# EAGLE design Adafruit T-Cobbler (EAGLE 6.2)
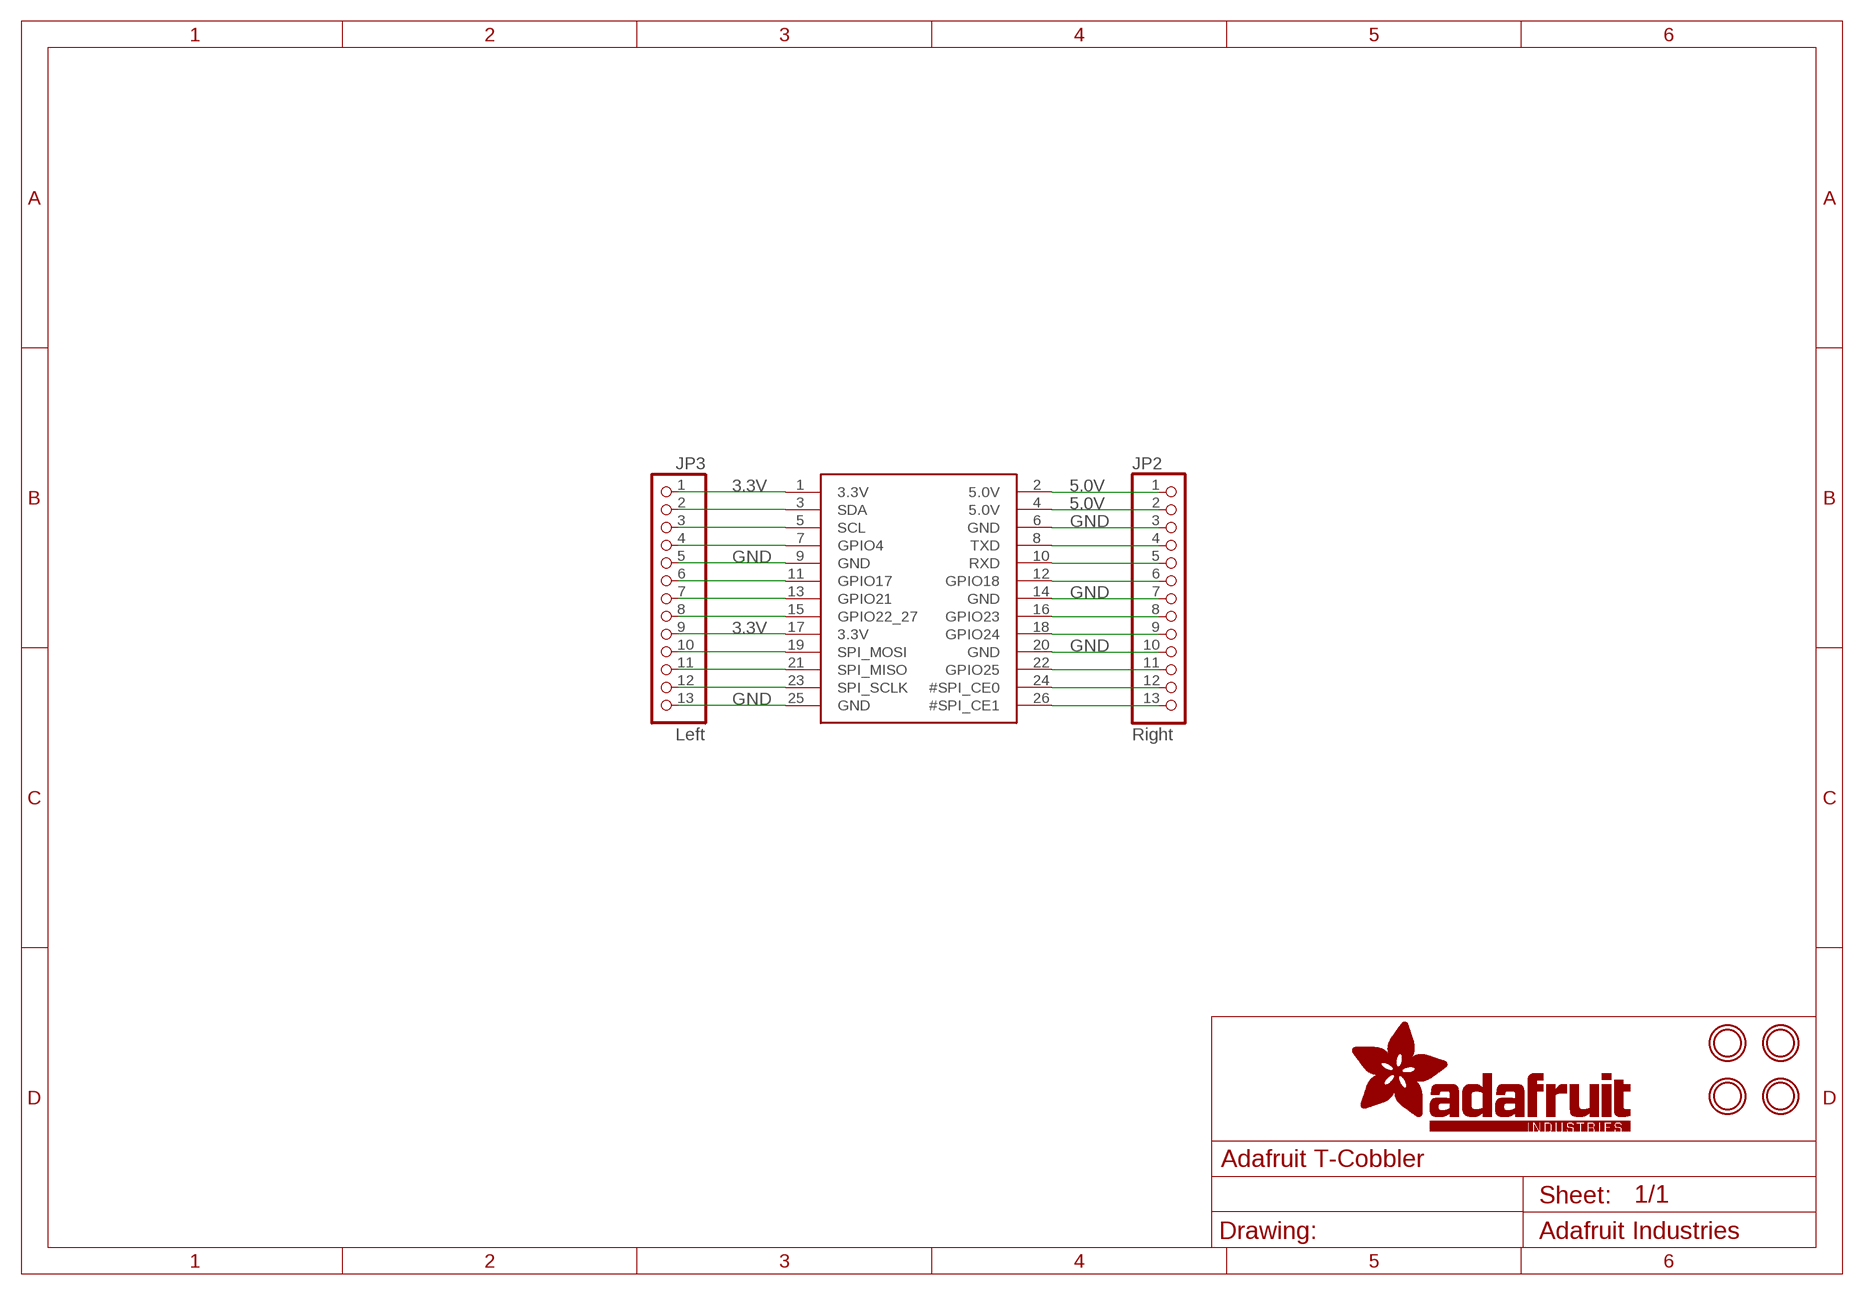
[diagram p0: schematic, sheet 1]

## Parts
JP1  PI  RASBERRYPI_IDC  [RASBERRYPI_IDC]
JP2  Right  HEADER-1X13  [1X13_ROUND_70]
JP3  Left  HEADER-1X13  [1X13_ROUND_70]
U$2  MOUNTINGHOLE2.5  [MOUNTINGHOLE_2.5_PLATED]
U$3  MOUNTINGHOLE2.5  [MOUNTINGHOLE_2.5_PLATED]
U$4  MOUNTINGHOLE2.5  [MOUNTINGHOLE_2.5_PLATED]
U$5  MOUNTINGHOLE2.5  [MOUNTINGHOLE_2.5_PLATED]

## Nets
3.3V: JP1.1(3.3V) JP1.17(3.3V) JP3.1 JP3.9
5.0V: JP1.2(5.0V) JP1.4(5.0V) JP2.1 JP2.2
GND: JP1.6(GND) JP1.9(GND) JP1.14(GND) JP1.20(GND) JP1.25(GND) JP2.3 JP2.7 JP2.10 JP3.5 JP3.13
N$1: JP1.3(SDA) JP3.2
N$2: JP1.5(SCL) JP3.3
N$3: JP1.7(GPIO4) JP3.4
N$5: JP1.11(GPIO17) JP3.6
N$6: JP1.13(GPIO21) JP3.7
N$7: JP1.15(GPIO22_27) JP3.8
N$9: JP1.19(SPI_MOSI) JP3.10
N$10: JP1.21(SPI_MISO) JP3.11
N$11: JP1.23(SPI_SCLK) JP3.12
N$15: JP1.8(TXD) JP2.4
N$16: JP1.10(RXD) JP2.5
N$17: JP1.12(GPIO18) JP2.6
N$19: JP1.16(GPIO23) JP2.8
N$20: JP1.18(GPIO24) JP2.9
N$22: JP1.22(GPIO25) JP2.11
N$23: JP1.24(#SPI_CE0) JP2.12
N$24: JP1.26(#SPI_CE1) JP2.13

## Library data of the parts
JP1 = microbuilder:RASBERRYPI_IDC: Rasberry PI IDC Header
JP2 JP3 = microbuilder:HEADER-1X13
U$2-U$5 = microbuilder:MOUNTINGHOLE: Mounting Hole For #2 screws (0.086"/2.18mm width, 0.094"/2.4mm hole) use 2.5mm

## Board
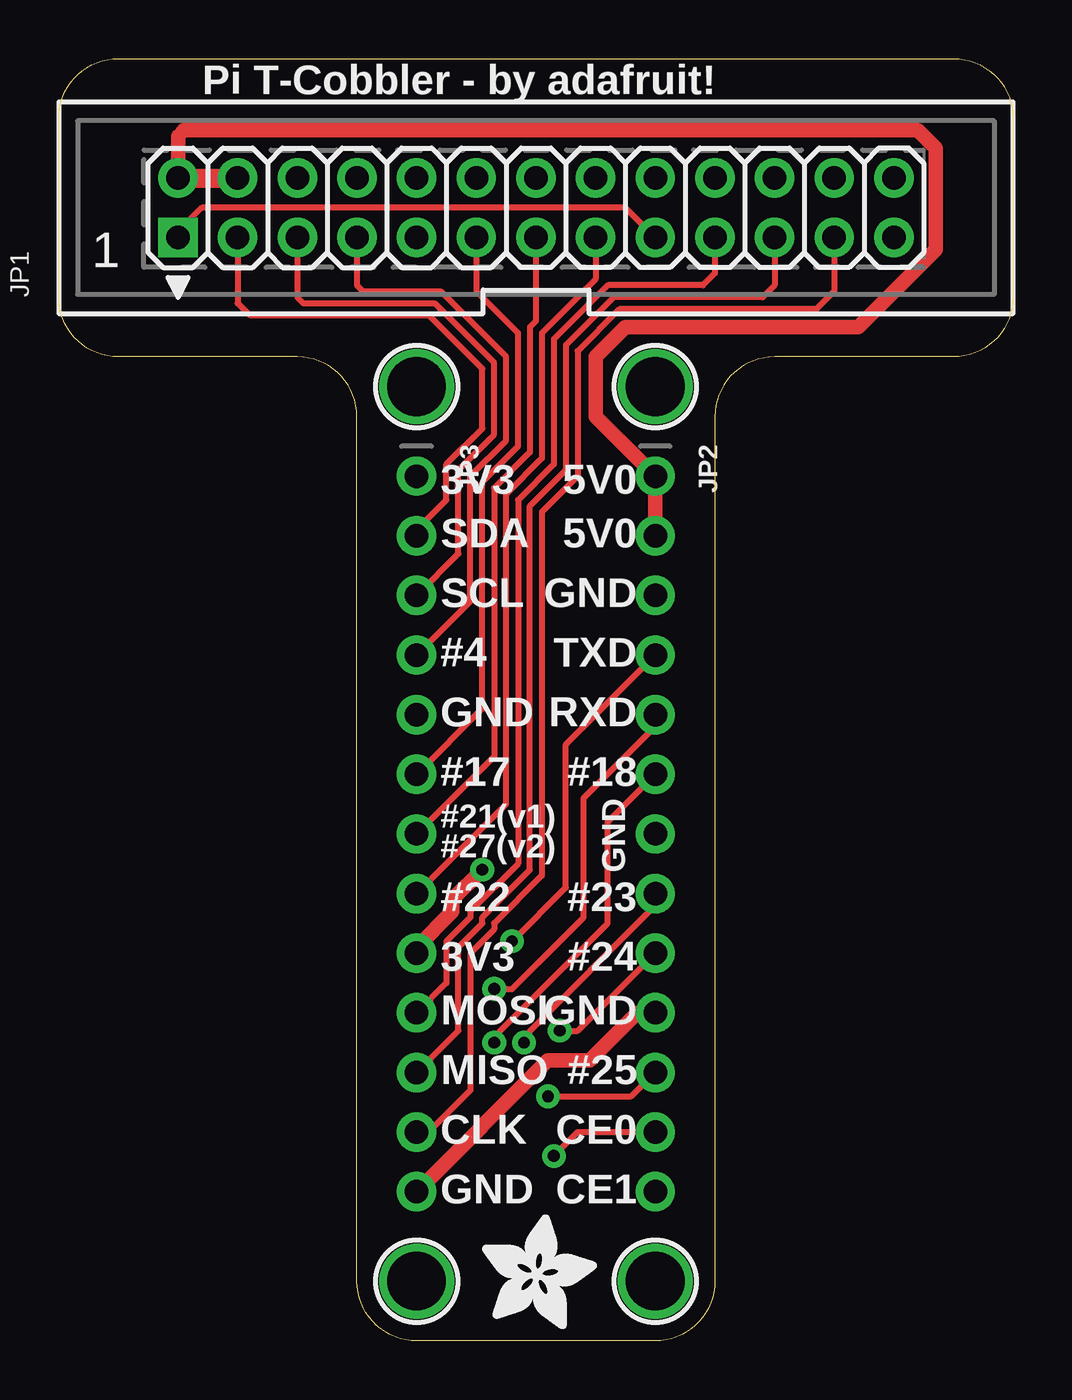
[diagram p1: board, top side]
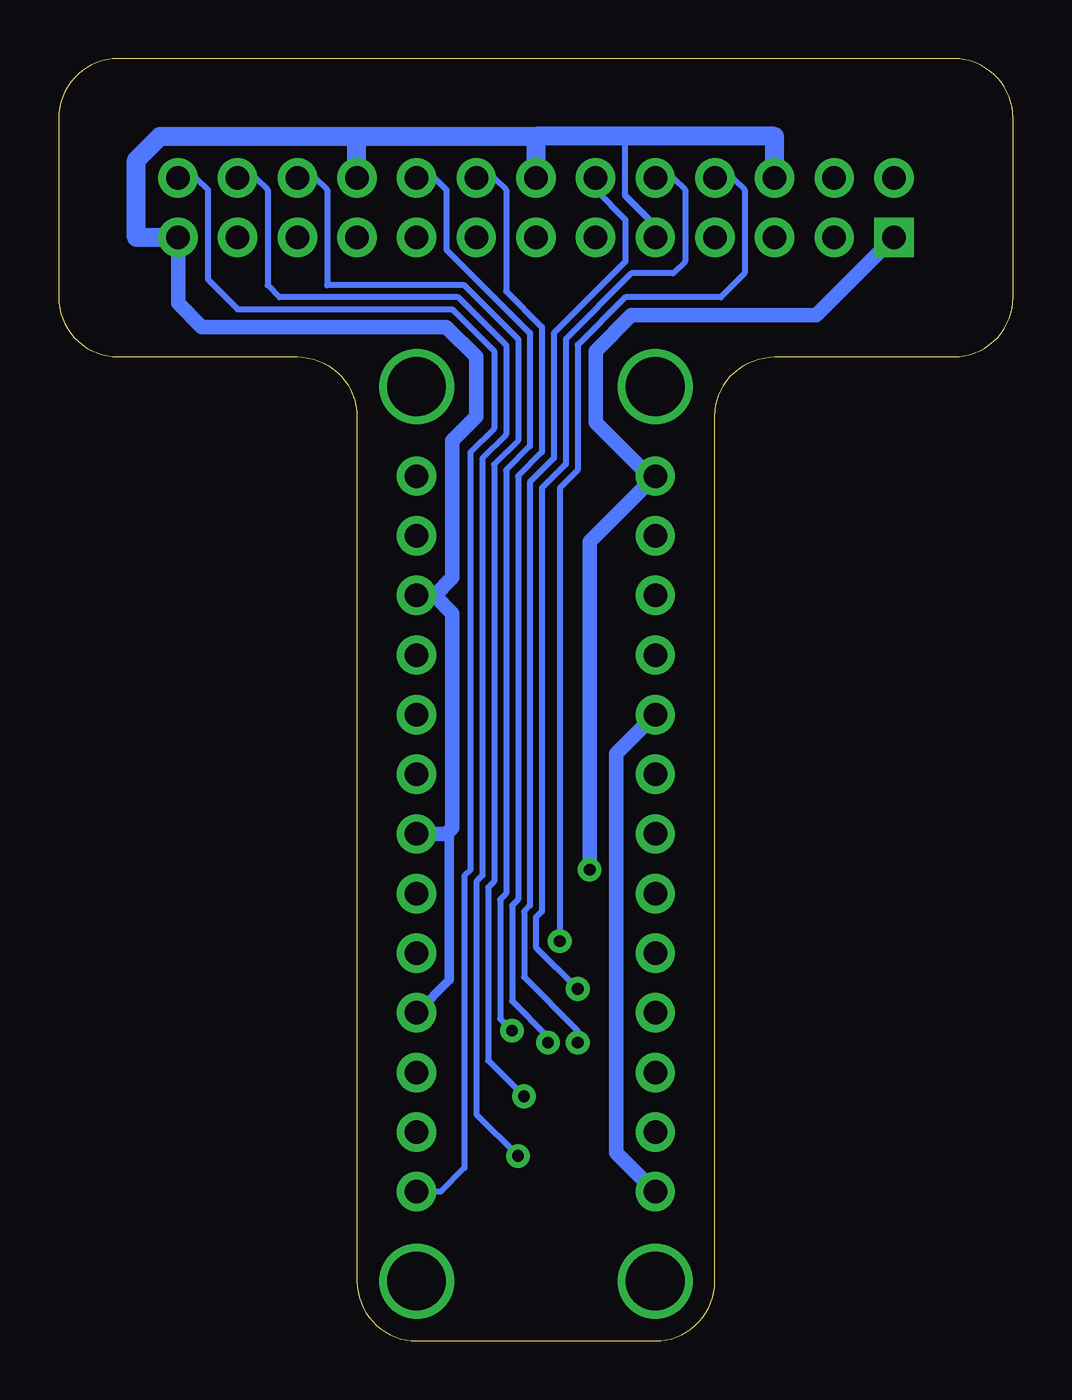
[diagram p2: board, bottom side, seen from below]

Size 40.64 x 54.61 mm. Coordinates in mm from the lower left corner, seen from the top.
Outline: 10.16,41.91 2.54,41.91 arc-90 0,44.45 0,52.07 arc-90 2.54,54.61 38.1,54.61 arc-90 40.64,52.07 40.64,44.45 arc-90 38.1,41.91 30.48,41.91 arc90 27.94,39.37 27.94,2.54 arc-90 25.4,0 15.24,0 arc-90 12.7,2.54 12.7,39.37 arc90 10.16,41.91
Copper layers (1*16): Top 0.035mm / dielectric 1.5mm / Bottom 0.035mm
Design rules: minimum track width 8mil, minimum drill 0.4mm, track to track 8mil, track to pad 8mil, pad to pad 8mil, via to via 8mil, smd to smd 8mil, copper to edge 20mil, drill to drill 8mil, minimum pad ring 8mil, minimum via ring 10mil, stop-mask expansion 3mil, vias tented up to drill 20mil, thermal gap 8mil

### Footprints (pad centres in the part's own frame; a part is rotated, then mirrored left to right if it is on the bottom)
RASBERRYPI_IDC = drill 1 pad 1.676 square: 1 -1.27,15.24 | drill 1 pad 1.676: 2 1.27,15.24; 3 -1.27,12.7; 4 1.27,12.7; 5 -1.27,10.16; 6 1.27,10.16; 7 -1.27,7.62; 8 1.27,7.62; 9 -1.27,5.08; 10 1.27,5.08; 11 -1.27,2.54; 12 1.27,2.54; 13 -1.27,0; 14 1.27,0; 15 -1.27,-2.54; 16 1.27,-2.54; 17 -1.27,-5.08; 18 1.27,-5.08; 19 -1.27,-7.62; 20 1.27,-7.62; 21 -1.27,-10.16; 22 1.27,-10.16; 23 -1.27,-12.7; 24 1.27,-12.7; 25 -1.27,-15.24; 26 1.27,-15.24
1X13_ROUND_70 = drill 1 pad 1.676: 1 -15.24,0; 2 -12.7,0; 3 -10.16,0; 4 -7.62,0; 5 -5.08,0; 6 -2.54,0; 7 0,0; 8 2.54,0; 9 5.08,0; 10 7.62,0; 11 10.16,0; 12 12.7,0; 13 15.24,0
MOUNTINGHOLE_2.5_PLATED = drill 2.5 pad 3.2: P$1 0,0

### Placement (x,y rotation side)
JP1  20.32,48.26 90 top
JP2  25.4,21.59 270 top
JP3  15.24,21.59 270 top
U$2  15.24,40.64 0 top
U$3  25.4,40.64 0 top
U$4  25.4,2.54 0 top
U$5  15.24,2.54 0 top
U$7  [ADAFRUIT_5MM]  18.03,0.51 0 top

### Tracks (layer width: path | path; a pad name or v marks a point on that pad's centre or on a via)
3.3V  (via drill 0.5)
  Top 0.254: JP1.17 24.13,48.26 6.1,48.26 5.08,47.24 JP1.1
  Top 0.61: v18.03,20.07 16.76,18.8 16.76,18.29 15.24,16.76 JP3.9
  Bottom 0.61: JP1.1 8.38,43.69 16.26,43.69 17.78,42.16 17.78,39.12 15.49,36.83 JP3.1 18.03,34.04 v18.03,20.07
5.0V
  Top 0.61: JP1.2 5.08,51.31 5.33,51.56 36.58,51.56 37.34,50.8 37.34,46.48 34.04,43.18 24.13,43.18 22.86,41.91 22.86,39.37 JP2.1 JP2.2
  Top 0.813: JP1.2 JP1.4
GND
  Top 0.61: JP3.13 20.83,11.94 22.61,11.94 24.64,13.97 JP2.10
  Bottom 0.254: 16.51,48.77 16.51,51.31
  Bottom 0.305: JP1.9 15.24,47.5 16.51,48.77
  Bottom 0.406: 24,21.72 24,15.37 JP2.10
  Bottom 0.61: JP2.7 24.13,21.59 24,21.72 23.88,21.84 23.88,30.99 24.64,31.75 | 24.64,31.75 JP2.3 | JP3.5 16.89,25.02 16.89,8 JP3.13 | 24.64,31.75 23.88,32.51 23.88,38.35 22.86,39.37 22.86,41.91 24.13,43.18 34.54,43.18 35.56,44.2 JP1.25
  Bottom 0.813: JP1.20 27.94,51.31 | 27.94,51.31 20.32,51.31 | 20.32,51.31 JP1.14 | JP1.6 10.16,51.31 16.51,51.31 20.32,51.31 | JP1.25 37.34,46.99 37.34,50.29 36.32,51.31 27.94,51.31
N$1
  Top 0.254: JP1.3 7.62,44.2 8.13,43.69 15.75,43.69 18.03,41.4 18.03,38.86 16.51,37.34 16.51,35.81 15.24,34.54 JP3.2
N$2
  Top 0.254: JP1.5 10.16,44.45 10.41,44.2 16,44.2 18.54,41.66 18.54,38.61 17.02,37.08 17.02,33.53 JP3.3
N$3
  Top 0.254: JP1.7 12.7,44.96 12.95,44.7 16.26,44.7 19.05,41.91 19.05,38.35 17.53,36.83 17.53,31.5 JP3.4
N$5
  Top 0.254: JP1.11 17.78,44.7 19.56,42.93 19.56,38.1 18.03,36.58 18.03,26.92 JP3.6
N$6
  Top 0.254: JP1.13 20.32,43.43 20.07,43.18 20.07,37.85 18.54,36.32 18.54,24.89 JP3.7
N$7
  Top 0.254: JP1.15 22.86,45.21 20.57,42.93 20.57,37.59 19.05,36.07 19.05,22.86 JP3.8
N$9
  Top 0.254: JP1.19 27.94,45.47 27.43,44.96 23.37,44.96 21.08,42.67 21.08,37.34 19.56,35.81 19.56,20.32 17.53,18.29 17.53,18.03 16.51,17.02 16.51,15.24 JP3.10
N$10
  Top 0.254: JP1.21 30.48,44.96 29.97,44.45 23.62,44.45 21.59,42.42 21.59,37.08 20.07,35.56 20.07,20.07 18.03,18.03 18.03,17.78 17.02,16.76 17.02,13.21 JP3.11
N$11
  Top 0.254: JP1.23 33.02,44.7 32.26,43.94 23.88,43.94 22.1,42.16 22.1,36.83 20.57,35.31 20.57,19.81 18.54,17.78 18.54,17.53 17.53,16.51 17.53,10.67 15.75,8.89 JP3.12
N$15  (via drill 0.5)
  Top 0.254: v19.3,17.02 21.59,19.3 21.59,25.4 JP2.4
  Bottom 0.254: JP1.8 11.94,49.53 11.43,49.02 11.43,45.47 12.45,44.45 16.51,44.45 18.54,42.42 18.54,37.08 19.3,36.32 v19.3,17.02
N$16  (via drill 0.5)
  Top 0.254: v18.54,14.99 19.3,14.99 22.35,18.03 22.35,23.11 25.4,26.16 JP2.5
  Bottom 0.254: JP1.10 14.48,49.53 13.97,49.02 13.97,45.97 14.48,45.47 16.26,45.47 19.05,42.67 19.05,37.34 20.07,36.32 20.07,18.29 20.32,18.03 20.32,16.76 v18.54,14.99
N$17  (via drill 0.5)
  Top 0.254: v18.54,12.7 18.54,12.95 23.37,17.78 23.37,22.1 JP2.6
  Bottom 0.254: JP1.12 17.78,49.02 16.51,47.75 16.51,45.97 19.56,42.93 19.56,37.59 20.57,36.58 20.57,18.54 20.83,18.29 20.83,15.49 18.54,13.21 v18.54,12.7
N$19  (via drill 0.5)
  Top 0.254: v19.81,12.7 19.81,12.95 25.4,18.54 JP2.8
  Bottom 0.254: JP1.16 22.1,49.53 21.59,49.02 21.59,44.7 20.07,43.18 20.07,37.85 21.08,36.83 21.08,18.8 21.34,18.54 21.34,14.48 19.81,12.95 v19.81,12.7
N$20  (via drill 0.5)
  Top 0.254: v21.34,13.21 22.1,13.21 JP2.9
  Bottom 0.254: JP1.18 24.64,49.53 24.13,49.02 24.13,46.48 20.57,42.93 20.57,38.1 21.59,37.08 21.59,19.05 21.84,18.8 21.84,13.72 v21.34,13.21
N$22  (via drill 0.5)
  Top 0.254: v20.83,10.41 24.38,10.41 JP2.11
  Bottom 0.254: JP1.22 29.72,49.53 29.21,49.02 29.21,44.96 23.37,44.96 21.08,42.67 21.08,38.35 22.1,37.34 22.1,19.56 22.35,19.3 22.35,11.94 v20.83,10.41
N$23  (via drill 0.5)
  Top 0.254: v21.08,7.87 22.1,8.89 JP2.12
  Bottom 0.254: JP1.24 32.26,49.53 31.75,49.02 31.75,44.96 31.24,44.45 23.62,44.45 21.59,42.42 21.59,38.61 22.61,37.59 22.61,19.81 22.86,19.56 22.86,9.65 v21.08,7.87
N$24
  Bottom 0.254: JP1.26 34.8,49.53 34.29,49.02 34.29,45.21 33.02,43.94 23.88,43.94 22.1,42.16 22.1,38.86 23.11,37.85 23.11,20.07 23.37,19.81 23.37,7.37 24.38,6.35 JP2.13

### Text on the board
tPlace: Pi T-Cobbler - by adafruit! | 5V0 | 3V3 | 5V0 | SDA | GND | SCL | TXD | #4 | RXD | GND | #18 | #17 | GND | #21(v1) | #27(v2) | #23 | #22 | #24 | 3V3 | GND | MOSI | #25 | MISO | CE0 | CLK | CE1 | GND